# Altium project CargadorDeBaterias.PrjPcb
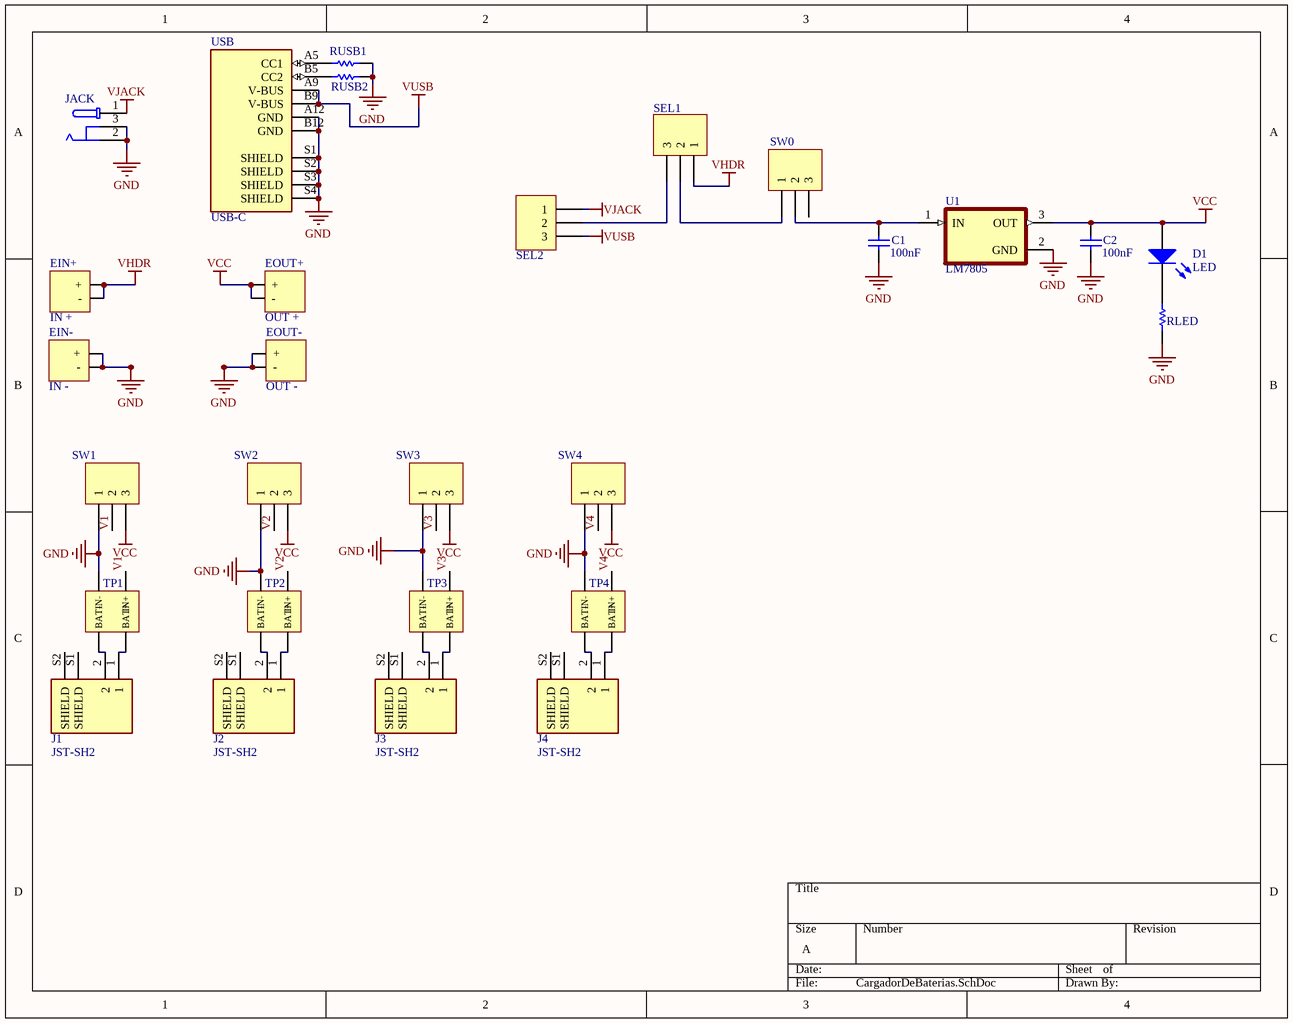
[diagram p0: CargadorDeBaterias.SchDoc]
1 sheet, 28 parts. Net scope: global (net labels, ports and power ports of the same name join across sheets).
Board file: CargadorDeBaterias.PcbDoc

## Sheet CargadorDeBaterias.SchDoc
size A

### Parts
C1  value 100nF  [CAP 0805]  (hidden comment: 0805 100nF Capacitor)
C2  value 100nF  [CAP 0805]  (hidden comment: 0805 100nF Capacitor)
D1  LED  [LED]
EIN+  IN +  [HEADER x2]
EIN-  IN -  [HEADER x2]
EOUT+  OUT +  [HEADER x2]
EOUT-  OUT -  [HEADER x2]
J1  JST-SH2  [JST-SH2]
J2  JST-SH2  [JST-SH2]
J3  JST-SH2  [JST-SH2]
J4  JST-SH2  [JST-SH2]
JACK  JACK 5MM  [JACK 5MM]  (value not drawn)
RLED  220ohm 0805 resistor  [RES 0805]  (value not drawn)
RUSB1  5,1Kohm 0805 resistor  [RES 0805]  (value not drawn)
RUSB2  5,1Kohm 0805 resistor  [RES 0805]  (value not drawn)
SEL1  (no value)  [SWITCH PALANCA]
SEL2  (no value)  [SWITCH PALANCA]
SW0  SLIDE SWITCH  [SWITCH PALANCA]  (value not drawn)
SW1  (no value)  [SWITCH PALANCA]
SW2  (no value)  [SWITCH PALANCA]
SW3  (no value)  [SWITCH PALANCA]
SW4  (no value)  [SWITCH PALANCA]
TP1  TP 4056  [TP 4056]  (value not drawn)
TP2  TP 4056  [TP 4056]  (value not drawn)
TP3  TP 4056  [TP 4056]  (value not drawn)
TP4  TP 4056  [TP 4056]  (value not drawn)
U1  LM7805  [TO220]
USB  USB-C  [USB-C]

### Nets
GND: C1.1 C2.1 EIN-.+ EIN-.- EOUT-.+ EOUT-.- JACK.2(GND) JACK.3(GND) RLED.1 RUSB1.2 RUSB2.2 SW1.1 SW2.1 SW3.1 SW4.1 TP1.1(IN-) TP2.1(IN-) TP3.1(IN-) TP4.1(IN-) U1.2(GND) USB.A12(GND) USB.B12(GND) USB.S1(SHIELD) USB.S2(SHIELD) USB.S3(SHIELD) USB.S4(SHIELD)
VCC: C2.2 D1.0(A) EOUT+.+ EOUT+.- SW1.3 SW2.3 SW3.3 SW4.3 U1.3(OUT)
VHDR: EIN+.+ EIN+.- SEL1.1
VJACK: JACK.1(VCC) SEL2.1
VUSB: SEL2.3 USB.A9(V-BUS) USB.B9(V-BUS)
V1: SW1.2 TP1.0(IN+)
V2: SW2.2 TP2.0(IN+)
V3: SW3.2 TP3.0(IN+)
V4: SW4.2 TP4.0(IN+)
NetC1_2: C1.2 SW0.2 U1.1(IN)
NetD1_1: D1.1(K) RLED.2
NetJ1_1: J1.1 TP1.2(BAT+)
NetJ1_2: J1.2 TP1.3(BAT-)
NetJ2_1: J2.1 TP2.2(BAT+)
NetJ2_2: J2.2 TP2.3(BAT-)
NetJ3_1: J3.1 TP3.2(BAT+)
NetJ3_2: J3.2 TP3.3(BAT-)
NetJ4_1: J4.1 TP4.2(BAT+)
NetJ4_2: J4.2 TP4.3(BAT-)
NetRUSB1_1: RUSB1.1 USB.A5(CC1)
NetRUSB2_1: RUSB2.1 USB.B5(CC2)
NetSEL1_2: SEL1.2 SW0.1
NetSEL1_3: SEL1.3 SEL2.2

Not connected (* = marked no-connect by the designer): J1 S1(SHIELD) S2(SHIELD); J2 S1(SHIELD) S2(SHIELD); J3 S1(SHIELD) S2(SHIELD); J4 S1(SHIELD) S2(SHIELD); SW0 3

### Library data of the parts
C1 C2 = Cap: Capacitor; Published: 8-Jun-2000; LatestRevisionDate: 17-Jul-2002; LatestRevisionNote: Re-released for DXP Platform.; PackageReference: RAD-0.3; Publisher: Altium Limited; PackageDescription: Radial Cap, Thru-Hole; 2 Leads; 0.3 in Pin Spacing
EIN+ EIN- EOUT+ EOUT- = HEADER X2: LatestRevisionDate: 17-Jul-2002; LatestRevisionNote: Re-released for DXP Platform.; Publisher: Altium Limited
J1-J4 = JST-SH2: MP: BM02B-SRSS-TB(LF)(SN); Package: None; Price: None; Value: *; Availability: Unavailable
JACK = JACK 5MM: MF: MPD; MP: EJ508A; Package: Non-Standard MPD; Value: *; SnapEDA_Link: https://www.snapeda.com/parts/EJ508A/MPD%20%28Memory%20Protection%20Devices%29/view-part/474399/?ref=snap; Price: None; Availability: Unavailable
RLED RUSB1 RUSB2 = RESISTOR 1/4W: Value: 3KΩ; Published: 8-Jun-2000; LatestRevisionDate: 17-Jul-2002; LatestRevisionNote: Re-released for DXP Platform.; PackageReference: AXIAL-0.3; Publisher: Altium Limited; PackageDescription: Axial Device, Thru-Hole; 2 Leads; 0.3 in Pin Spacing
SEL1 SEL2 SW1-SW4 = Header 3: LatestRevisionDate: 17-Jul-2002; LatestRevisionNote: Re-released for DXP Platform.; Publisher: Altium Limited
U1 = LM7805: MF: ON Semiconductor; MP: LM7805CT; Purchase-URL: https://pricing.snapeda.com/search/part/LM7805CT/?ref=eda; Check_prices: https://www.snapeda.com/parts/LM7805CT/Onsemi/view-part/?ref=eda; SnapEDA_Link: https://www.snapeda.com/parts/LM7805CT/Onsemi/view-part/?ref=snap; Price: None; Availability: In Stock; Package: TO-220-3 ON Semiconductor; Value: *
USB = USB-C: Type C, 3 A, Right Angle, Surface Mount (SMT), Power-Only USB Receptacle; MP: UJC-HP-3-SMT-TR; Value: *; Availability: Unavailable; Price: None; Package: None
D1 = LED: Published: 8-Jun-2000; LatestRevisionDate: 08-Jul-2005; LatestRevisionNote: Mech Layer 1 removed.; PackageReference: LED-0; Publisher: Altium Limited; PackageDescription: LED; 2 Leads
SW0 = SLIDE SWITCH: LatestRevisionDate: 17-Jul-2002; LatestRevisionNote: Re-released for DXP Platform.; Publisher: Altium Limited